# Altium schematic sheet USB.SchDoc
size A
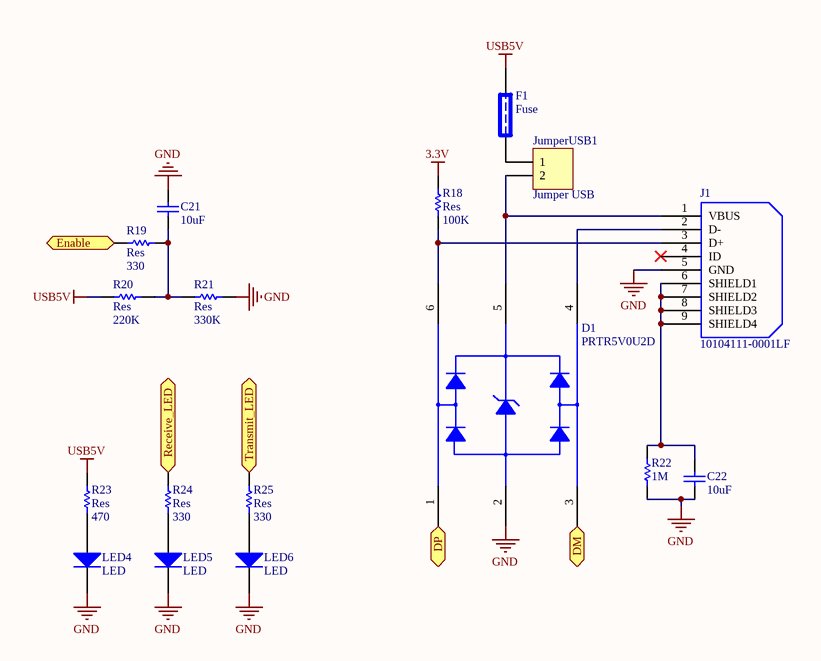
[diagram p0: USB.SchDoc]

## Parts
C21  value 10uF  [2012[0805]]  (hidden comment: Cap_UP)
C22  value 10uF  [2012[0805]]  (hidden comment: Cap_UP)
D1  value PRTR5V0U2D  [PRTR5V0U2D]  (hidden comment: PRTR5V0U2X)
F1  Fuse  [3216[1206]]
J1  value 10104111-0001LF  [USB_MINI]  (hidden comment: USB_AB)
JumperUSB1  Jumper USB  [HDR1X2]
LED4  LED  [2012[0805]]
LED5  LED  [2012[0805]]
LED6  LED  [2012[0805]]
R18  Res  value 100K  [2012[0805]]
R19  Res  value 330  [2012[0805]]
R20  Res  value 220K  [2012[0805]]
R21  Res  value 330K  [2012[0805]]
R22  1M  [2012[0805]]
R23  Res  value 470  [2012[0805]]
R24  Res  value 330  [2012[0805]]
R25  Res  value 330  [2012[0805]]

## Ports
DM, DP, Enable (out), Receive_LED (in), Transmit_LED (in)

## Nets
3.3V: R18.1
GND: C21.1 C22.1 D1.2(GND) J1.5(GND) LED4.2(K) LED5.2(K) LED6.2(K) R21.2 R22.1
USB5V: F1.2 R20.1 R23.1
DM: D1.3(I/O2) ; port DM
DP: D1.1(I/O_1) ; port DP
Enable: R19.1 ; port Enable
Receive_LED: R24.1 ; port Receive_LED
Transmit_LED: R25.1 ; port Transmit_LED
NetC21_2: C21.2 R19.2 R20.2 R21.1
NetC22_2: C22.2 J1.6(SHIELD1) J1.7(SHIELD2) J1.8(SHIELD3) J1.9(SHIELD4) R22.2
NetD1_4: D1.4(I/O2) J1.2(D-)
NetD1_5: D1.5(VCC) J1.1(VBUS) JumperUSB1.2
NetD1_6: D1.6(I/O1) J1.3(D+) R18.2
NetF1_1: F1.1 JumperUSB1.1
NetLED4_1: LED4.1(A) R23.2
NetLED5_1: LED5.1(A) R24.2
NetLED6_1: LED6.1(A) R25.2

Not connected (* = marked no-connect by the designer): J1 4(ID)*

## Library data of the parts
C21 C22 = Cap_UP: Capacitor; Published: 8-Jun-2000; LatestRevisionDate: 17-Jul-2002; LatestRevisionNote: Re-released for DXP Platform.; PackageReference: RAD-0.3; Publisher: Altium Limited
D1 = PRTR5V0U2D: Double rail-to-rail USB ESD protection diode; OrcadPartType: Integrated Circuits&Special function&Protection; Manufacturer: Philips; AN: A06-0236; TemperatureRange: -40 to +85 C; PartType: Buy; Height: 1,10000002384186; MPN: PRTR5V0U2X
J1 = USB_AB: Micro USB AB Connector; PartGroup: Mechanical devices,Connectors,USB; Manufacturer: FCI; AN: A08-1368; Height: 2.59999990463257; MPN: 10104111-0001LF
JumperUSB1 = Header 2: Header, 2-Pin; LatestRevisionDate: 17-Jul-2002; LatestRevisionNote: Re-released for DXP Platform.; Publisher: Altium Limited
LED4-LED6 = Diode: 1 Amp General Purpose Rectifier; Revision 1: 11-Jul-2000: SIM Model Added.; Revision 2: 17-Jul-2002: Re-released for DXP Platform.; Package Information: Latest Revision: Aug-1999; Code - JEDEC: DO-204-AL; Published: 8-Jun-2000; Datasheet: Latest Revision: 1998; Package Reference: DO-41; Publisher: Altium Limited
R18-R25 = Res: Semiconductor Resistor; Published: 8-Jun-2000; LatestRevisionDate: 17-Jul-2002; LatestRevisionNote: Re-released for DXP Platform.; PackageReference: AXIAL-0.5; Publisher: Altium Limited
  R22: Value: 1M
F1 = Fuse: Published: 8-Jun-2000; LatestRevisionDate: 17-Jul-2002; LatestRevisionNote: Re-released for DXP Platform.; PackageReference: PIN-W2/E2.8; Publisher: Altium Limited